# Altium schematic sheet LEDs.SchDoc
size A4; SheetNumber: 8; SheetTotal: 9
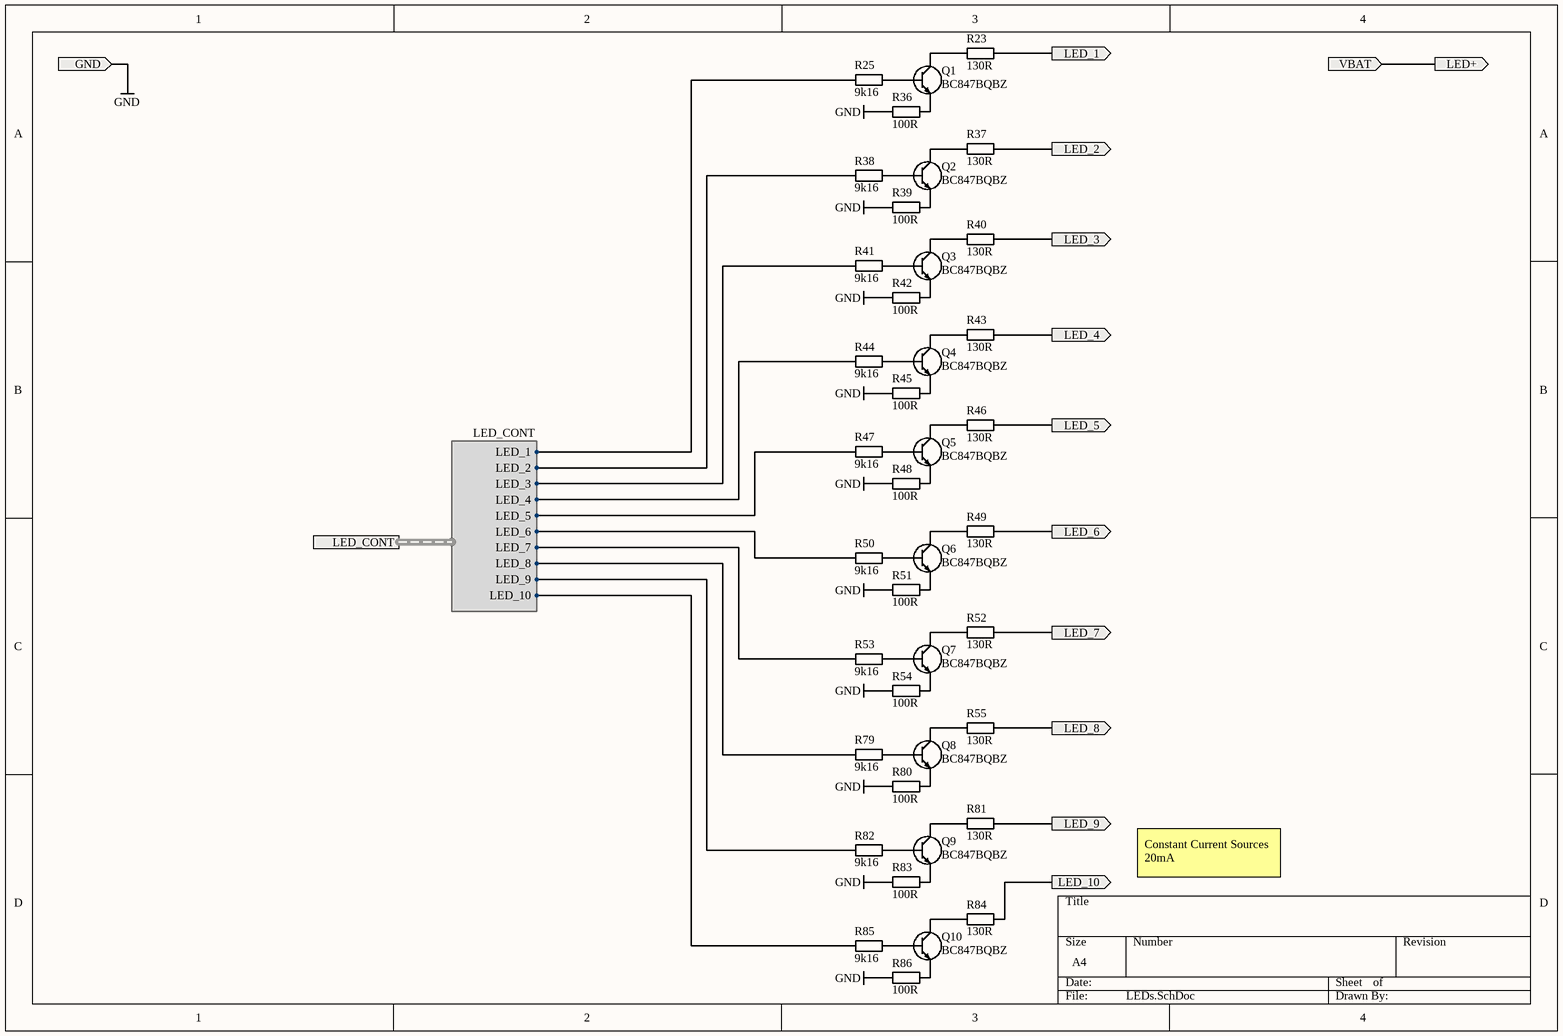
[diagram p0: LEDs.SchDoc]

## Parts
Q1  BC847BQBZ  [PESD2CANFD24UQBZ]
Q2  BC847BQBZ  [PESD2CANFD24UQBZ]
Q3  BC847BQBZ  [PESD2CANFD24UQBZ]
Q4  BC847BQBZ  [PESD2CANFD24UQBZ]
Q5  BC847BQBZ  [PESD2CANFD24UQBZ]
Q6  BC847BQBZ  [PESD2CANFD24UQBZ]
Q7  BC847BQBZ  [PESD2CANFD24UQBZ]
Q8  BC847BQBZ  [PESD2CANFD24UQBZ]
Q9  BC847BQBZ  [PESD2CANFD24UQBZ]
Q10  BC847BQBZ  [PESD2CANFD24UQBZ]
R23  130R  [R_1210]
R25  9k16  [R_0402]
R36  100R  [R_1210]
R37  130R  [R_1210]
R38  9k16  [R_0402]
R39  100R  [R_1210]
R40  130R  [R_1210]
R41  9k16  [R_0402]
R42  100R  [R_1210]
R43  130R  [R_1210]
R44  9k16  [R_0402]
R45  100R  [R_1210]
R46  130R  [R_1210]
R47  9k16  [R_0402]
R48  100R  [R_1210]
R49  130R  [R_1210]
R50  9k16  [R_0402]
R51  100R  [R_1210]
R52  130R  [R_1210]
R53  9k16  [R_0402]
R54  100R  [R_1210]
R55  130R  [R_1210]
R79  9k16  [R_0402]
R80  100R  [R_1210]
R81  130R  [R_1210]
R82  9k16  [R_0402]
R83  100R  [R_1210]
R84  130R  [R_1210]
R85  9k16  [R_0402]
R86  100R  [R_1210]

## Ports
GND (in), LED+ (out), LED_1 (out), LED_2 (out), LED_3 (out), LED_4 (out), LED_5 (out), LED_6 (out), LED_7 (out), LED_8 (out), LED_9 (out), LED_10 (out), LED_CONT (harness LED_CONT), VBAT (in)

## Harnesses
LED_CONT: LED_1, LED_2, LED_3, LED_4, LED_5, LED_6, LED_7, LED_8, LED_9, LED_10

## Nets
GND: R36.2 R39.2 R42.2 R45.2 R48.2 R51.2 R54.2 R80.2 R83.2 R86.2 ; port GND
LED+: port VBAT, port LED+
LED_1: R23.2 ; port LED_1
LED_2: R37.2 ; port LED_2
LED_3: R40.2 ; port LED_3
LED_4: R43.2 ; port LED_4
LED_5: R46.2 ; port LED_5
LED_6: R49.2 ; port LED_6
LED_7: R52.2 ; port LED_7
LED_8: R55.2 ; port LED_8
LED_9: R81.2 ; port LED_9
LED_10: R84.2 ; port LED_10
NetQ1_1: Q1.1(B) R25.2
NetQ1_2: Q1.2(E) R36.1
NetQ1_3: Q1.3(C) R23.1
NetQ2_1: Q2.1(B) R38.2
NetQ2_2: Q2.2(E) R39.1
NetQ2_3: Q2.3(C) R37.1
NetQ3_1: Q3.1(B) R41.2
NetQ3_2: Q3.2(E) R42.1
NetQ3_3: Q3.3(C) R40.1
NetQ4_1: Q4.1(B) R44.2
NetQ4_2: Q4.2(E) R45.1
NetQ4_3: Q4.3(C) R43.1
NetQ5_1: Q5.1(B) R47.2
NetQ5_2: Q5.2(E) R48.1
NetQ5_3: Q5.3(C) R46.1
NetQ6_1: Q6.1(B) R50.2
NetQ6_2: Q6.2(E) R51.1
NetQ6_3: Q6.3(C) R49.1
NetQ7_1: Q7.1(B) R53.2
NetQ7_2: Q7.2(E) R54.1
NetQ7_3: Q7.3(C) R52.1
NetQ8_1: Q8.1(B) R79.2
NetQ8_2: Q8.2(E) R80.1
NetQ8_3: Q8.3(C) R55.1
NetQ9_1: Q9.1(B) R82.2
NetQ9_2: Q9.2(E) R83.1
NetQ9_3: Q9.3(C) R81.1
NetQ10_1: Q10.1(B) R85.2
NetQ10_2: Q10.2(E) R86.1
NetQ10_3: Q10.3(C) R84.1
NetR25_1: R25.1 ; port LED_CONT.LED_1
NetR38_1: R38.1 ; port LED_CONT.LED_2
NetR41_1: R41.1 ; port LED_CONT.LED_3
NetR44_1: R44.1 ; port LED_CONT.LED_4
NetR47_1: R47.1 ; port LED_CONT.LED_5
NetR50_1: R50.1 ; port LED_CONT.LED_6
NetR53_1: R53.1 ; port LED_CONT.LED_7
NetR79_1: R79.1 ; port LED_CONT.LED_8
NetR82_1: R82.1 ; port LED_CONT.LED_9
NetR85_1: R85.1 ; port LED_CONT.LED_10

## Notes on the sheet
- Constant Current Sources 20mA

## Library data of the parts
Q1-Q10 = BC847BQBZ: NPN Transistor 45V 100mA 100MHz; Manufacturer_Name: Nexperia; Manufacturer_Part_Number: BC847CQBZ; Datasheet Link: https://assets.nexperia.com/documents/data-sheet/BC847XQB_SER.pdf; Height: 0.5mm; Mouser Part Number: 771-BC847CQBZ; Mouser Price/Stock: https://www.mouser.co.uk/ProductDetail/Nexperia/BC847CQBZ?qs=GBLSl2AkirulMH7yF0zTsA%3D%3D
R23 R37 R40 R43 R46 R49 R52 R55 R81 R84 = ERJP14F1300U: 130R 1% 500mW
R25 R38 R41 R44 R47 R50 R53 R79 R82 R85 = MCMR04X6191FTL: 9k16 1% 62.5mW
R36 R39 R42 R45 R48 R51 R54 R80 R83 R86 = ERJP14F1000U: 100R 1% 500mW